# Altium schematic sheet Battery_Charger.SchDoc
size A; SheetNumber: 1; SheetTotal: 4
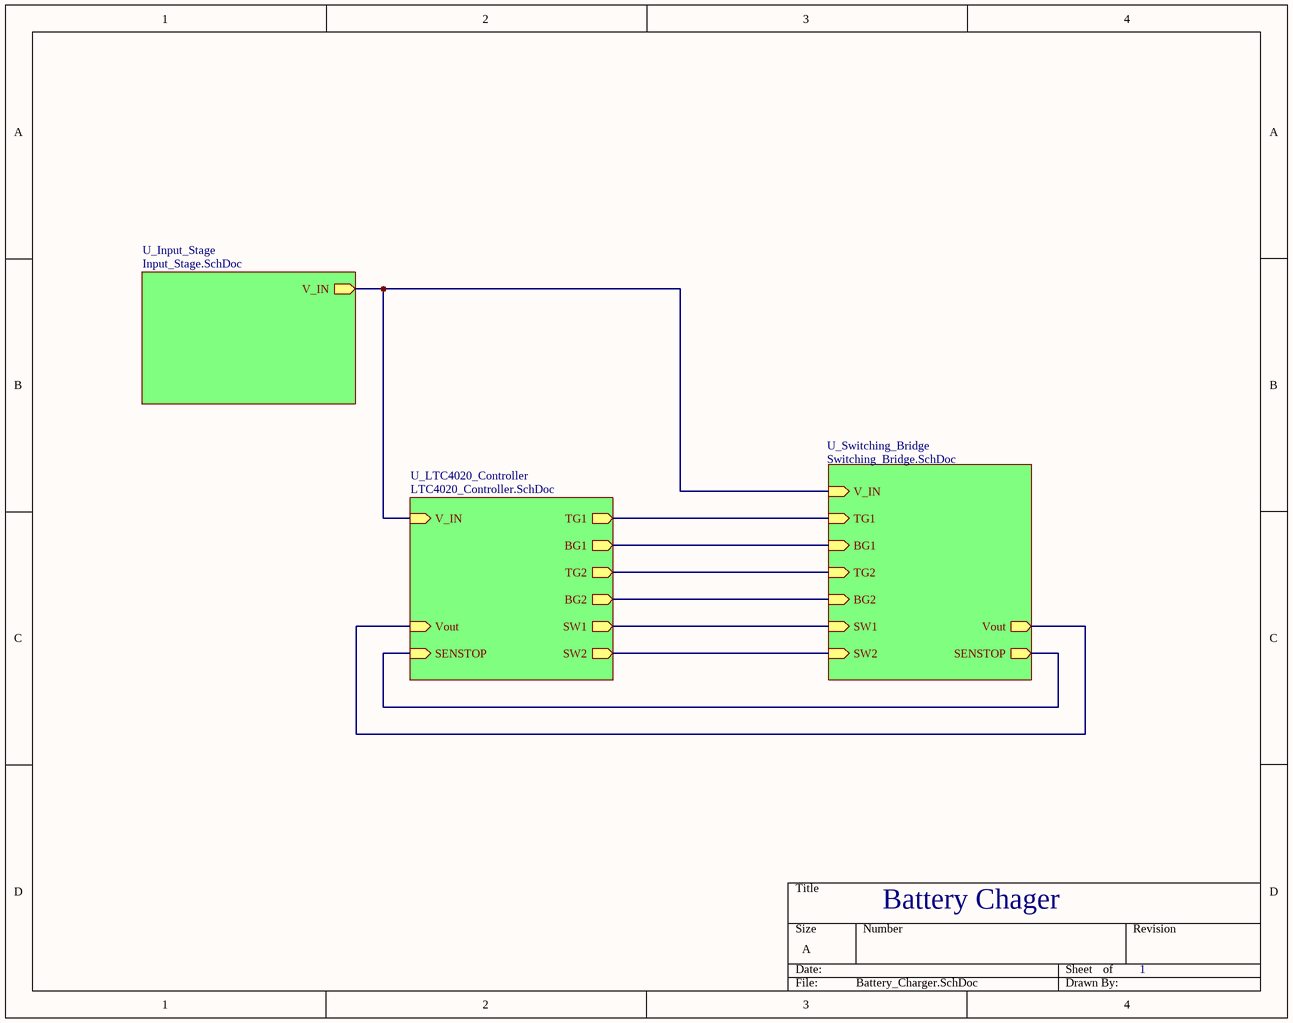
[diagram p0: Battery_Charger.SchDoc]

## Sub-sheets
U_Input_Stage = Input_Stage.SchDoc: V_IN (out)
U_LTC4020_Controller = LTC4020_Controller.SchDoc: TG1 (out), BG1 (out), TG2 (out), BG2 (out), V_IN (in), SENSTOP (in), SW1 (out), SW2 (out), Vout (in)
U_Switching_Bridge = Switching_Bridge.SchDoc: BG1 (in), BG2 (in), TG1 (in), TG2 (in), V_IN (in), Vout (out), SENSTOP (out), SW1 (in), SW2 (in)

## Nets
(unnamed): sheet U_LTC4020_Controller/TG1, sheet U_Switching_Bridge/TG1
(unnamed): sheet U_LTC4020_Controller/BG1, sheet U_Switching_Bridge/BG1
(unnamed): sheet U_LTC4020_Controller/TG2, sheet U_Switching_Bridge/TG2
(unnamed): sheet U_LTC4020_Controller/BG2, sheet U_Switching_Bridge/BG2
(unnamed): sheet U_LTC4020_Controller/V_IN, sheet U_Switching_Bridge/V_IN, sheet U_Input_Stage/V_IN
(unnamed): sheet U_LTC4020_Controller/SENSTOP, sheet U_Switching_Bridge/SENSTOP
(unnamed): sheet U_LTC4020_Controller/SW1, sheet U_Switching_Bridge/SW1
(unnamed): sheet U_LTC4020_Controller/SW2, sheet U_Switching_Bridge/SW2
(unnamed): sheet U_LTC4020_Controller/Vout, sheet U_Switching_Bridge/Vout

## Notes on the sheet
- Battery Chager
- 1